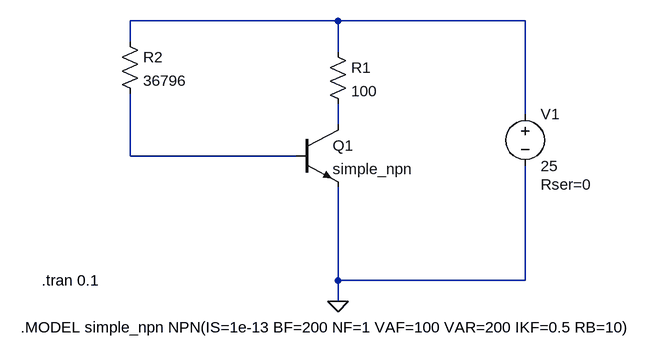
[diagram p0: schematic Eigen_RW_1e.asc]
Eigen_RW_1e.asc, the LTspice schematic file:
Version 4
SHEET 1 4936 824
WIRE 240 -32 -80 -32
WIRE 528 -32 240 -32
WIRE -80 0 -80 -32
WIRE 240 16 240 -32
WIRE 528 112 528 -32
WIRE 240 128 240 96
WIRE -80 176 -80 80
WIRE 176 176 -80 176
WIRE 240 368 240 224
WIRE 528 368 528 192
WIRE 528 368 240 368
WIRE 240 400 240 368
FLAG 240 400 0
SYMBOL res 224 0 R0
SYMATTR InstName R1
SYMATTR Value 100
SYMBOL voltage 528 96 R0
WINDOW 123 0 0 Left 0
WINDOW 39 24 124 Left 2
SYMATTR SpiceLine Rser=0
SYMATTR InstName V1
SYMATTR Value 25
SYMBOL res -96 -16 R0
SYMATTR InstName R2
SYMATTR Value 36796
SYMBOL npn 176 128 R0
SYMATTR InstName Q1
SYMATTR Value simple_npn
TEXT -216 368 Left 2 !.tran 0.1
TEXT -248 440 Left 2 !.MODEL simple_npn NPN(IS=1e-13 BF=200 NF=1 VAF=100 VAR=200 IKF=0.5 RB=10)

The netlist it stands for:
* Eigen_RW_1e.asc
R1 N001 N002 100
V1 N001 0 25 Rser=0
R2 N001 N003 36796
Q1 N002 N003 0 0 simple_npn
.model NPN NPN
.model PNP PNP
.lib standard.bjt
.tran 0.1
.MODEL simple_npn NPN(IS=1e-13 BF=200 NF=1 VAF=100 VAR=200 IKF=0.5 RB=10)
.backanno
.end